# EAGLE design ARE_adaptadora_dsPIC-PIC32_28pin (EAGLE 6.5.0)
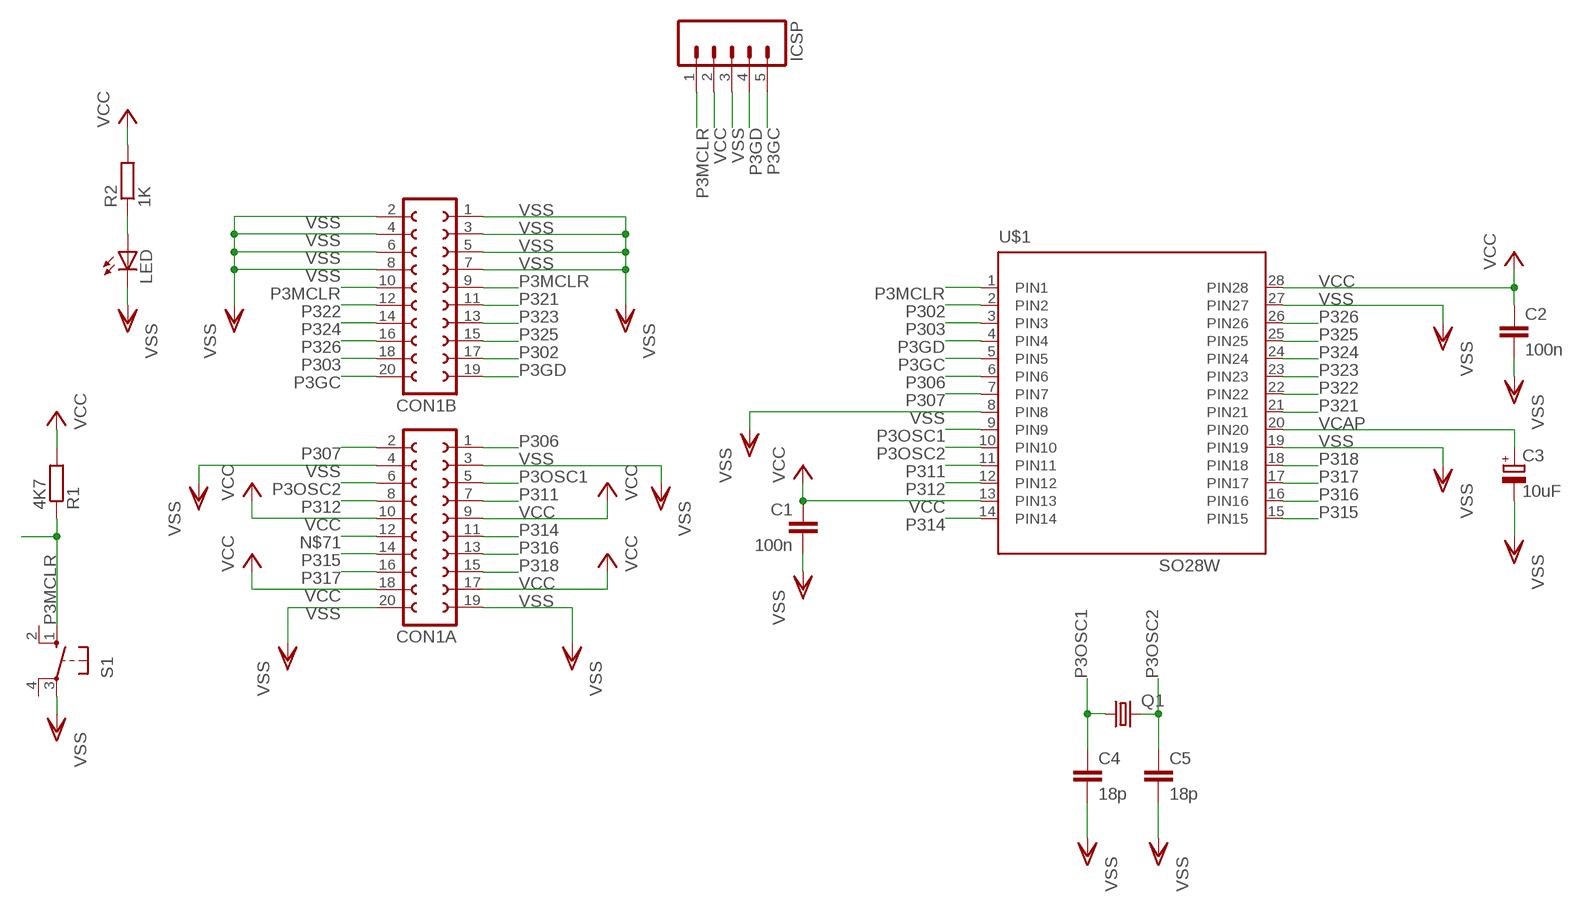
[diagram p0: schematic, sheet 1]

## Parts
C1  100n  C-EUC0805  [C0805]
C2  100n  C-EUC0805  [C0805]
C3  10uF  CPOL-EUSMCC  [SMC_C]
C4  18p  C-EUC0805  [C0805]
C5  18p  C-EUC0805  [C0805]
CON1A  FE10-2W  [FE10-2W]
CON1B  FE10-2W  [FE10-2W]
ICSP  M05PTH  [1X05]
LED  LEDCHIPLED_0805  [CHIPLED_0805]
Q1  CRYSTALHC18U-V  [HC18U-V]
R1  4K7  R-EU_R0805  [R0805]
R2  1K  R-EU_R0805  [R0805]
S1  10-XX  [B3F-10XX]
U$1  SO28W  [SO28W]

## Nets
N$3: LED.A R2.1
N$71: CON1A.12
P3GC: CON1B.20 ICSP.5 U$1.5(PIN5)
P3GD: CON1B.19 ICSP.4 U$1.4(PIN4)
P3MCLR: CON1B.9 CON1B.10 ICSP.1 R1.1 S1.1(S) U$1.1(PIN1)
P3OSC1: C4.1 CON1A.5 Q1.1 U$1.9(PIN9)
P3OSC2: C5.1 CON1A.6 Q1.2 U$1.10(PIN10)
P302: CON1B.17 U$1.2(PIN2)
P303: CON1B.18 U$1.3(PIN3)
P306: CON1A.1 U$1.6(PIN6)
P307: CON1A.2 U$1.7(PIN7)
P311: CON1A.7 U$1.11(PIN11)
P312: CON1A.8 U$1.12(PIN12)
P314: CON1A.11 U$1.14(PIN14)
P315: CON1A.14 U$1.15(PIN15)
P316: CON1A.13 U$1.16(PIN16)
P317: CON1A.16 U$1.17(PIN17)
P318: CON1A.15 U$1.18(PIN18)
P321: CON1B.11 U$1.21(PIN21)
P322: CON1B.12 U$1.22(PIN22)
P323: CON1B.13 U$1.23(PIN23)
P324: CON1B.14 U$1.24(PIN24)
P325: CON1B.15 U$1.25(PIN25)
P326: CON1B.16 U$1.26(PIN26)
VCAP: C3.+ U$1.20(PIN20)
VCC: C1.1 C2.1 CON1A.9 CON1A.10 CON1A.17 CON1A.18 ICSP.2 R1.2 R2.2 U$1.13(PIN13) U$1.28(PIN28)
VSS: C1.2 C2.2 C3.- C4.2 C5.2 CON1A.3 CON1A.4 CON1A.19 CON1A.20 CON1B.1 CON1B.2 CON1B.3 CON1B.4 CON1B.5 CON1B.6 CON1B.7 CON1B.8 ICSP.3 LED.C S1.3(P) U$1.8(PIN8) U$1.19(PIN19) U$1.27(PIN27)
Unconnected: S1.2(S1) S1.4(P1)

## Library data of the parts
C1 C2 C4 C5 = rcl:C-EU: CAPACITOR, European symbol
C3 = rcl:CPOL-EU: POLARIZED CAPACITOR, European symbol
CON1A CON1B = con-lsta:FE10-2W: FEMALE HEADER; OC_FARNELL: unknown; OC_NEWARK: unknown
ICSP = SparkFun:M05: Header 5 Standard 5-pin 0.1" header. Use with straight break away headers (SKU : PRT-00116), right angle break away headers (PRT-00553), swiss pins (PRT-00743), machine pins (PRT-00117), and female headers (PRT-00115). Molex polarized connector foot print use with SKU : PRT-08230 with associated crimp pins and housings.
LED = led:LED: LED OSRAM: - CHIPLED LG R971, LG N971, LY N971, LG Q971, LY Q971, LO R971, LY R971 LH N974, LH R974 LS Q976, LO Q976, LY Q976 LO Q996 - Hyper CHIPLED LW Q18S LB Q993, LB Q99A, LB R99A - SideLED LS A670, LO A670, LY A670, LG A670, LP A670 LB A673, LV A673, LT A673, LW A673 LH A674 LY A675 LS A676, LA A676, LO A676, LY A676, LW A676 LS A679, LY A679, LG A679 - Hyper Micro SIDELED® LS Y876, LA Y876, LO Y876, LY Y876 LT Y87S - SmartLED LW L88C, LW L88S LB L89C, LB L89S, LG L890 LS L89K, LO L89K, LY L89K LS L896, LA L896, LO L896, LY L896 - TOPLED LS T670, LO T670, LY T670, LG T670, LP T670 LSG T670, LSP T670, LSY T670, LOP T670, LYG T670 LG T671, LOG T671, LSG T671 LB T673, LV T673, LT T673, LW T673 LH T674 LS T676, LA T676, LO T676, LY T676, LB T676, LH T676, LSB T676, LW T676 LB T67C, LV T67C, LT T67C, LS T67K, LO T67K, LY T67K, LW E67C LS E67B, LA E67B, LO E67B, LY E67B, LB E67C, LV E67C, LT E67C LW T67C LS T679, LY T679, LG T679 LS T770, LO T770, LY T770, LG T770, LP T770 LB T773, LV T773, LT T773, LW T773 LH T774 LS E675, LA E675, LY E675, LS T675 LS T776, LA T776, LO T776, LY T776, LB T776 LHGB T686 LT T68C, LB T68C - Hyper Mini TOPLED® LB M676 - Mini TOPLED Santana® LG M470 LS M47K, LO M47K, LY M47K Source: http://www.osram.convergy.de LUXEON: - LUMILED® LXK2-PW12-R00, LXK2-PW12-S00, LXK2-PW14-U00, LXK2-PW14-V00 LXK2-PM12-R00, LXK2-PM12-S00, LXK2-PM14-U00 LXK2-PE12-Q00, LXK2-PE12-R00, LXK2-PE12-S00, LXK2-PE14-T00, LXK2-PE14-U00 LXK2-PB12-K00, LXK2-PB12-L00, LXK2-PB12-M00, LXK2-PB14-N00, LXK2-PB14-P00, LXK2-PB14-Q00 LXK2-PR12-L00, LXK2-PR12-M00, LXK2-PR14-Q00, LXK2-PR14-R00 LXK2-PD12-Q00, LXK2-PD12-R00, LXK2-PD12-S00 LXK2-PH12-R00, LXK2-PH12-S00 LXK2-PL12-P00, LXK2-PL12-Q00, LXK2-PL12-R00 Source: www.luxeon.com KINGBRIGHT: KA-3528ASYC Source: www.kingbright.com
Q1 = crystal:CRYSTAL: CRYSTAL; OC_FARNELL: unknown; OC_NEWARK: unknown
R1 R2 = rcl:R-EU_: RESISTOR, European symbol
S1 = switch-omron:10-XX: OMRON SWITCH; MPN: B3F-1000; OC_FARNELL: 176432; OC_NEWARK: 36M3542
U$1 = SMD:SO28W

## Board
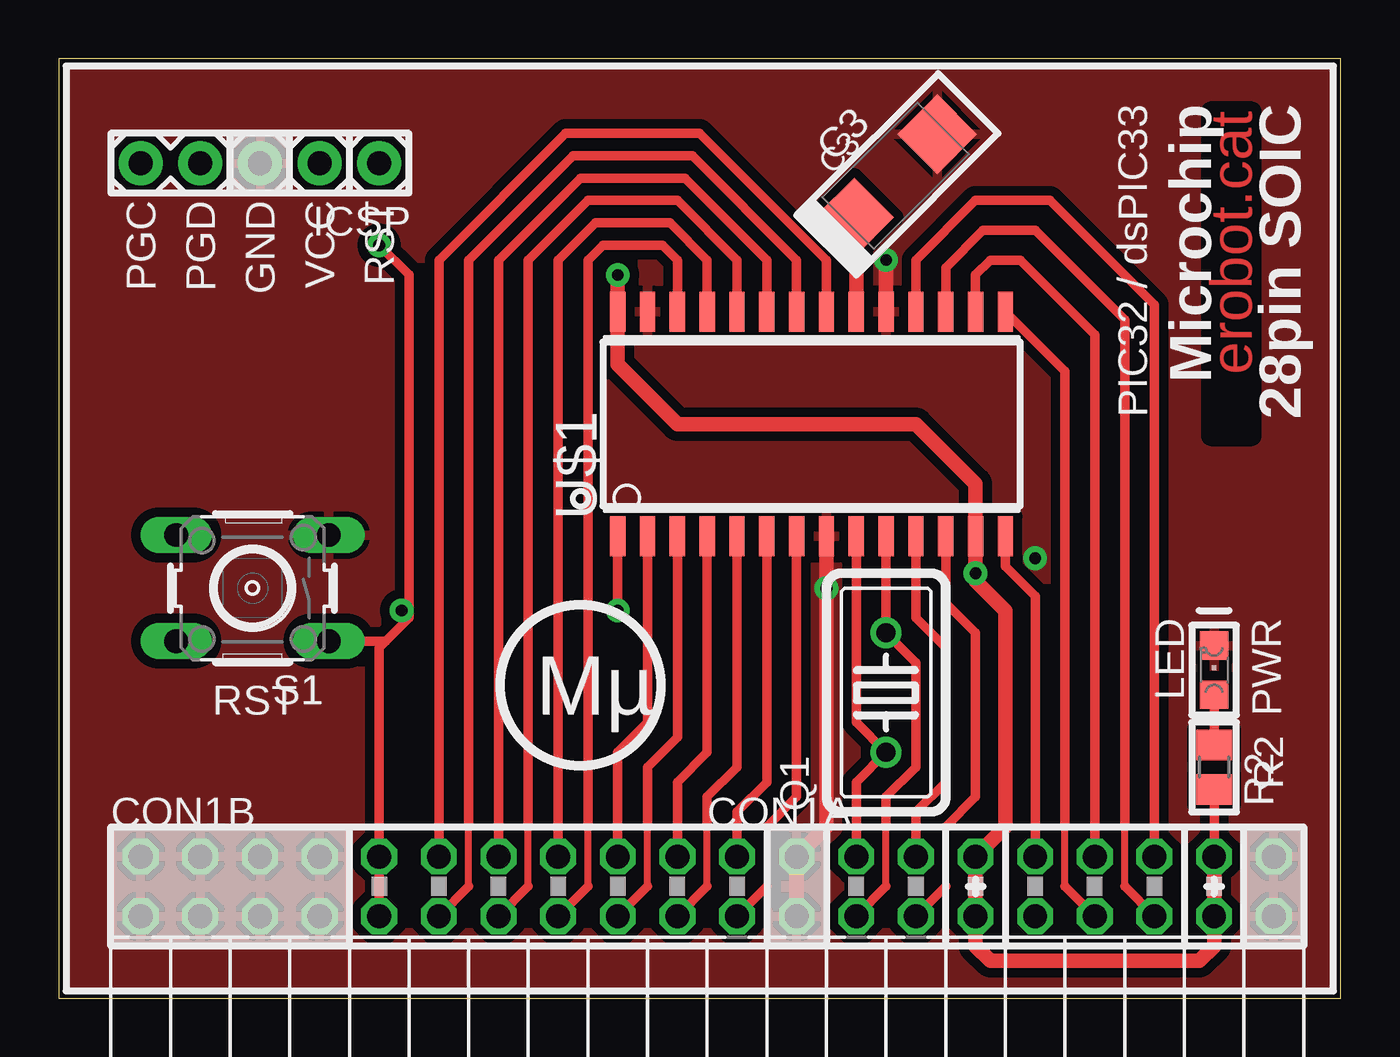
[diagram p1: board, top side]
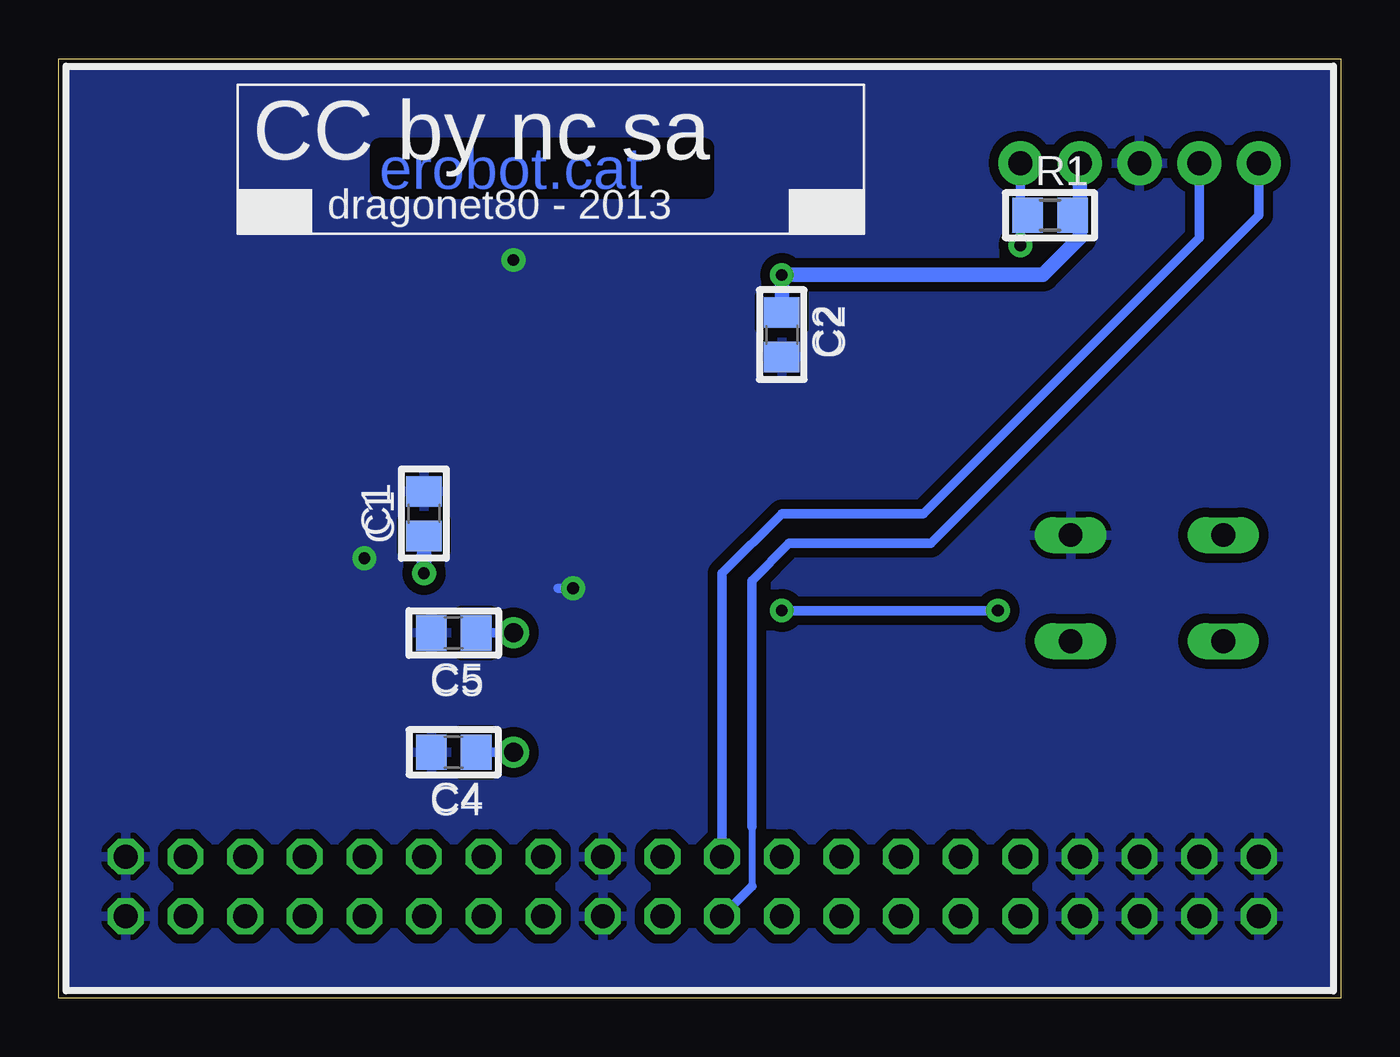
[diagram p2: board, bottom side, seen from below]

Size 54.61 x 40 mm. Coordinates in mm from the lower left corner, seen from the top.
Outline: 0,0 54.61,0 54.61,40 0,40 0,0
Copper layers (1*16): Top 0.035mm / dielectric 1.5mm / Bottom 0.035mm
Design rules "ITEADstudio_DRC": minimum track width 6mil, minimum drill 12mil, track to track 6mil, track to pad 6mil, pad to pad 6mil, via to via 6mil, smd to smd 0mil, copper to edge 10mil, drill to drill 10mil, minimum pad ring 10mil, minimum via ring 6mil, stop-mask expansion 2mil, vias tented up to drill 100mil, thermal gap 10mil

### Footprints (pad centres in the part's own frame; a part is rotated, then mirrored left to right if it is on the bottom)
C0805 = smd 1.3 x 1.5: 1 -0.95,0; 2 0.95,0
SMC_C = smd 2.4 x 2.4: + -2.5,0; - 2.5,0
FE10-2W = drill 1.016 octagon: 1 -11.43,1.27; 2 -11.43,-1.27; 3 -8.89,1.27; 4 -8.89,-1.27; 5 -6.35,1.27; 6 -6.35,-1.27; 7 -3.81,1.27; 8 -3.81,-1.27; 9 -1.27,1.27; 10 -1.27,-1.27; 11 1.27,1.27; 12 1.27,-1.27; 13 3.81,1.27; 14 3.81,-1.27; 15 6.35,1.27; 16 6.35,-1.27; 17 8.89,1.27; 18 8.89,-1.27; 19 11.43,1.27; 20 11.43,-1.27
1X05 = drill 1.016 pad 1.88: 1 0,0; 2 2.54,0; 3 5.08,0; 4 7.62,0; 5 10.16,0
CHIPLED_0805 = smd 1.2 x 1.2: A 0,-1.05; C 0,1.05
HC18U-V = drill 0.813: 1 -2.54,0; 2 2.54,0
R0805 = smd 1.3 x 1.5: 1 -0.95,0; 2 0.95,0
B3F-10XX = drill 1.016 long: 1 -3.251,2.261; 2 3.251,2.261; 3 -3.251,-2.261; 4 3.251,-2.261
SO28W = smd 0.65 x 1.7: 1 -7.62,-4.78; 2 -6.35,-4.78; 3 -5.08,-4.78; 4 -3.81,-4.78; 5 -2.54,-4.78; 6 -1.27,-4.78; 7 0,-4.78; 8 1.27,-4.78; 9 2.54,-4.78; 10 3.81,-4.78; 11 5.08,-4.78; 12 6.35,-4.78; 13 7.62,-4.78; 14 8.89,-4.78; 15 8.89,4.78; 16 7.62,4.78; 17 6.35,4.78; 18 5.08,4.78; 19 3.81,4.78; 20 2.54,4.78; 21 1.27,4.78; 22 0,4.78; 23 -1.27,4.78; 24 -2.54,4.78; 25 -3.81,4.78; 26 -5.08,4.78; 27 -6.35,4.78; 28 -7.62,4.78

### Placement (x,y rotation side)
C1  39.05,20.64 90 bottom
C2  23.81,28.26 270 bottom
C3  35.65,35.02 45 top
C4  37.78,10.48 180 bottom
C5  37.78,15.56 180 bottom
CON1A  40.32,4.76 0 top
CON1B  14.92,4.76 0 top
ICSP  13.65,35.56 180 top
LED  49.21,13.97 0 top
Q1  35.24,13.02 90 top
R1  12.38,33.34 0 bottom
R2  49.21,9.84 270 top
S1  8.25,17.46 180 top
U$1  31.43,24.45 0 top

### Tracks (layer width: path | path; a pad name or v marks a point on that pad's centre or on a via)
N$3
  Top 0.406: R2.1 LED.A
P3GC
  Top 0.305: 27.62,4.76 27.62,7.3
  Top 0.406: U$1.5 28.89,9.84 27.62,8.57 27.62,7.3 | CON1B.20 27.62,4.76
  Bottom 0.305: 25.08,7.3 25.08,4.76
  Bottom 0.406: ICSP.5 3.49,33.34 17.46,19.37 23.49,19.37 25.08,17.78 25.08,7.3 | 25.08,4.76 CON1B.20
P3GD
  Top 0.406: U$1.4 27.62,10.48 26.35,9.21 CON1B.19
  Bottom 0.406: ICSP.4 6.03,32.39 17.78,20.64 23.81,20.64 26.35,18.1 CON1B.19
P3MCLR  (via drill 0.5 pad 1.02)
  Top 0.406: U$1.1 v23.81,16.51 | CON1B.10 CON1B.9 13.65,14.92 13.93,15.2 | v13.65,32.07 14.92,30.8 14.92,16.51 | S1.1 13.93,15.2 | 13.93,15.2 14.92,16.19 14.92,16.51 | v14.6,16.51 14.92,16.51
  Bottom 0.406: v23.81,16.51 v14.6,16.51 | v13.65,32.07 13.65,33.34 | 13.65,33.34 ICSP.1 | R1.1 13.65,33.34
P3OSC1
  Top 0.406: U$1.9 33.97,11.75 Q1.1 33.97,9.21 CON1A.5
  Bottom 0.406: C4.1 Q1.1
P3OSC2
  Top 0.305: 35.24,4.76 35.24,7.3
  Top 0.406: U$1.10 Q1.2 36.51,14.29 36.51,9.84 35.24,8.57 35.24,7.3 | CON1A.6 35.24,4.76
  Bottom 0.406: C5.1 Q1.2
P302
  Top 0.406: U$1.2 25.08,11.75 23.81,10.48 CON1B.17
P303
  Top 0.305: 25.08,4.76 25.08,7.3
  Top 0.406: U$1.3 26.35,11.11 25.08,9.84 25.08,7.3 | CON1B.18 25.08,4.76
P306
  Top 0.406: CON1A.1 28.89,7.94 30.16,9.21 U$1.6
P307
  Top 0.305: 30.16,7.3 30.16,4.76
  Top 0.406: 30.16,7.3 31.43,8.57 U$1.7 | 30.16,4.76 CON1A.2
P311
  Top 0.406: U$1.11 36.51,16.19 37.78,14.92 37.78,9.21 36.51,7.94 CON1A.7
P312
  Top 0.305: 37.78,4.76 37.78,7.3
  Top 0.406: U$1.12 37.78,16.83 39.05,15.56 39.05,8.57 37.78,7.3 | CON1A.8 37.78,4.76
P314
  Top 0.406: U$1.14 40.32,18.4 41.59,17.13 CON1A.11
P315
  Top 0.305: 42.86,4.76 42.86,7.3
  Top 0.406: U$1.15 42.86,26.69 42.86,7.3 | CON1A.14 42.86,4.76
P316
  Top 0.406: U$1.16 39.05,30.8 39.69,31.43 40.96,31.43 44.13,28.26 CON1A.13
P317
  Top 0.305: 45.4,4.76 45.4,7.3
  Top 0.406: U$1.17 37.78,31.12 39.37,32.7 41.59,32.7 45.4,28.89 45.4,7.3 | CON1A.16 45.4,4.76
P318
  Top 0.406: U$1.18 36.51,31.43 39.05,33.97 42.23,33.97 46.67,29.53 CON1A.15
P321
  Top 0.406: U$1.21 32.7,31.43 27.3,36.83 21.59,36.83 16.19,31.43 CON1B.11
P322
  Top 0.305: 17.46,4.76 17.46,7.3
  Top 0.406: U$1.22 31.43,31.43 26.99,35.88 21.91,35.88 17.46,31.43 17.46,7.3 | CON1B.12 17.46,4.76
P323
  Top 0.406: U$1.23 30.16,31.43 26.67,34.92 22.22,34.92 18.73,31.43 CON1B.13
P324
  Top 0.305: 20,4.76 20,7.3
  Top 0.406: U$1.24 28.89,31.43 26.35,33.97 22.54,33.97 20,31.43 20,7.3 | CON1B.14 20,4.76
P325
  Top 0.406: U$1.25 27.62,31.43 26.04,33.02 22.86,33.02 21.27,31.43 CON1B.15
P326
  Top 0.305: 22.54,4.76 22.54,7.3
  Top 0.406: U$1.26 26.35,31.43 25.72,32.07 23.18,32.07 22.54,31.43 22.54,7.3 | CON1B.16 22.54,4.76
VCAP
  Top 0.61: C3.+ 33.97,33.16 U$1.20
VCC  (via drill 0.5 pad 1.02)
  Top 0.406: R2.2 CON1A.17
  Top 0.61: v23.81,30.8 U$1.28 23.81,26.99 26.35,24.45 36.51,24.45 39.05,21.91 U$1.13 v39.05,18.1 39.05,17.78 40.32,16.51 40.32,7.3 CON1A.9 CON1A.10 39.05,2.22 39.69,1.59 48.58,1.59 49.21,2.22 CON1A.18 CON1A.17
  Bottom 0.406: R1.2 11.11,33.34
  Bottom 0.61: C1.1 v39.05,18.1 | C2.1 v23.81,30.8 12.7,30.8 11.11,32.39 11.11,33.34 ICSP.2
VSS  (via drill 0.5 pad 1.02)
  Top 0.61: U$1.8 v32.7,17.46 32.7,7.3 CON1A.3 CON1A.4 | U$1.19 v35.24,31.43
  Bottom 0.406: v32.7,17.46 33.34,17.46
  other vias: 41.59,18.73
  pour Top (isolate 0.406): 0.63,39.69 54.29,39.69 54.29,0.32 0.32,0.32 0.32,39.69
  pour Bottom (isolate 0.406): 0.32,39.69 54.29,39.69 54.29,0.32 0.32,0.32

### Text on the board
Top: erobot.cat
Bottom: erobot.cat
_tsilk: PIC32 / dsPIC33 | Microchip | 28pin SOIC | C3 | PGC | PGD | GND | VCC | RST | PWR | RST | Mµ | R2
_bsilk: CC by nc sa | dragonet80 - 2013 | C2 | C1 | C5 | C4